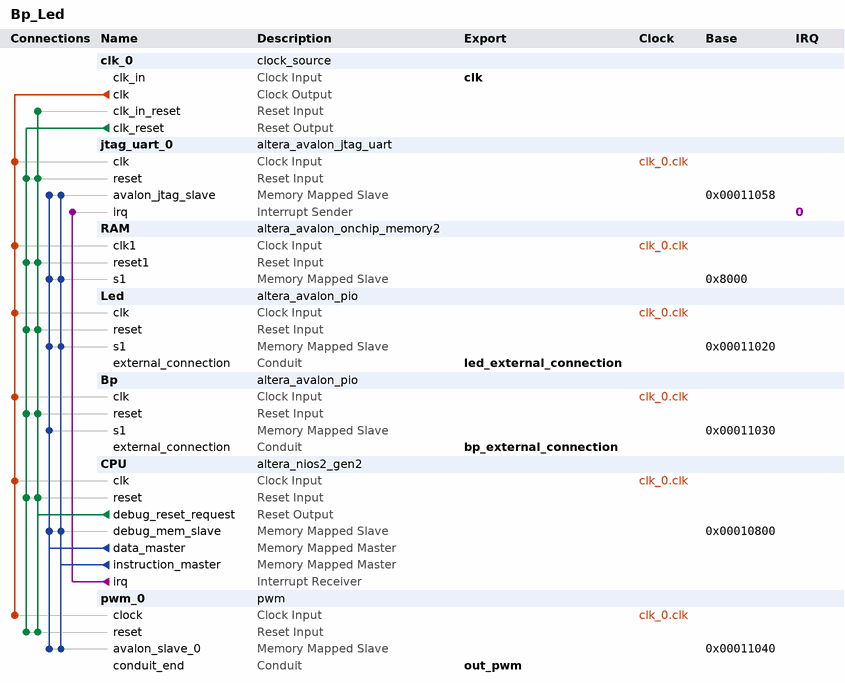
[diagram p0: system contents]
# Platform Designer (Qsys) system Bp_Led, Cyclone IV E EP4CE22F17C6
# Parameters at their usual value, and those the tool derives, are not listed.
package require -exact qsys 18.1
create_system Bp_Led
set_project_property DEVICE_FAMILY {Cyclone IV E}
set_project_property DEVICE EP4CE22F17C6

add_instance clk_0 clock_source 18.1
set_instance_parameter_value clk_0 clockFrequency 50000000

add_instance jtag_uart_0 altera_avalon_jtag_uart 18.1
set_instance_parameter_value jtag_uart_0 simInteractiveOptions NO_INTERACTIVE_WINDOWS

add_instance RAM altera_avalon_onchip_memory2 18.1
set_instance_parameter_value RAM dataWidth 32
set_instance_parameter_value RAM dualPort false
set_instance_parameter_value RAM initMemContent true
set_instance_parameter_value RAM initializationFileName onchip_mem.hex
set_instance_parameter_value RAM memorySize 20000

add_instance Led altera_avalon_pio 18.1
set_instance_parameter_value Led direction Output
set_instance_parameter_value Led width 8

add_instance Bp altera_avalon_pio 18.1
set_instance_parameter_value Bp direction Input
set_instance_parameter_value Bp width 2

add_instance CPU altera_nios2_gen2 18.1
set_instance_parameter_value CPU dcache_size 2048
set_instance_parameter_value CPU exceptionSlave RAM.s1
set_instance_parameter_value CPU icache_size 4096
set_instance_parameter_value CPU impl Tiny
set_instance_parameter_value CPU resetSlave RAM.s1

add_instance pwm_0 pwm 1.0

# connections
add_connection clk_0.clk Bp.clk clock
add_connection clk_0.clk CPU.clk clock
add_connection clk_0.clk jtag_uart_0.clk clock
add_connection clk_0.clk Led.clk clock
add_connection clk_0.clk pwm_0.clock clock
add_connection clk_0.clk RAM.clk1 clock
add_connection clk_0.clk_reset Bp.reset reset
add_connection clk_0.clk_reset CPU.reset reset
add_connection clk_0.clk_reset jtag_uart_0.reset reset
add_connection clk_0.clk_reset Led.reset reset
add_connection clk_0.clk_reset pwm_0.reset reset
add_connection clk_0.clk_reset RAM.reset1 reset
add_connection CPU.debug_reset_request Bp.reset reset
add_connection CPU.debug_reset_request clk_0.clk_in_reset reset
add_connection CPU.debug_reset_request CPU.reset reset
add_connection CPU.debug_reset_request jtag_uart_0.reset reset
add_connection CPU.debug_reset_request Led.reset reset
add_connection CPU.debug_reset_request pwm_0.reset reset
add_connection CPU.debug_reset_request RAM.reset1 reset
add_connection CPU.data_master Bp.s1 avalon
set_connection_parameter_value CPU.data_master/Bp.s1 baseAddress 0x00011030
add_connection CPU.data_master CPU.debug_mem_slave avalon
set_connection_parameter_value CPU.data_master/CPU.debug_mem_slave baseAddress 0x00010800
add_connection CPU.data_master jtag_uart_0.avalon_jtag_slave avalon
set_connection_parameter_value CPU.data_master/jtag_uart_0.avalon_jtag_slave baseAddress 0x00011058
add_connection CPU.data_master Led.s1 avalon
set_connection_parameter_value CPU.data_master/Led.s1 baseAddress 0x00011020
add_connection CPU.data_master pwm_0.avalon_slave_0 avalon
set_connection_parameter_value CPU.data_master/pwm_0.avalon_slave_0 baseAddress 0x00011040
add_connection CPU.data_master RAM.s1 avalon
set_connection_parameter_value CPU.data_master/RAM.s1 baseAddress 0x8000
add_connection CPU.instruction_master CPU.debug_mem_slave avalon
set_connection_parameter_value CPU.instruction_master/CPU.debug_mem_slave baseAddress 0x00010800
add_connection CPU.instruction_master jtag_uart_0.avalon_jtag_slave avalon
set_connection_parameter_value CPU.instruction_master/jtag_uart_0.avalon_jtag_slave baseAddress 0x00011058
add_connection CPU.instruction_master Led.s1 avalon
set_connection_parameter_value CPU.instruction_master/Led.s1 baseAddress 0x00011020
add_connection CPU.instruction_master pwm_0.avalon_slave_0 avalon
set_connection_parameter_value CPU.instruction_master/pwm_0.avalon_slave_0 baseAddress 0x00011040
add_connection CPU.instruction_master RAM.s1 avalon
set_connection_parameter_value CPU.instruction_master/RAM.s1 baseAddress 0x8000
add_connection CPU.irq jtag_uart_0.irq interrupt
set_connection_parameter_value CPU.irq/jtag_uart_0.irq irqNumber 0

# exported interfaces
add_interface bp_external_connection conduit end
set_interface_property bp_external_connection EXPORT_OF Bp.external_connection
add_interface clk clock sink
set_interface_property clk EXPORT_OF clk_0.clk_in
add_interface led_external_connection conduit end
set_interface_property led_external_connection EXPORT_OF Led.external_connection
add_interface out_pwm conduit end
set_interface_property out_pwm EXPORT_OF pwm_0.conduit_end

set_interconnect_requirement {$system} qsys_mm.clockCrossingAdapter HANDSHAKE
set_interconnect_requirement {$system} qsys_mm.enableEccProtection FALSE
set_interconnect_requirement {$system} qsys_mm.insertDefaultSlave FALSE
set_interconnect_requirement {$system} qsys_mm.maxAdditionalLatency 1

save_system Bp_Led.qsys
